# EAGLE schematic GPSSDver2 (EAGLE 9.6.2)
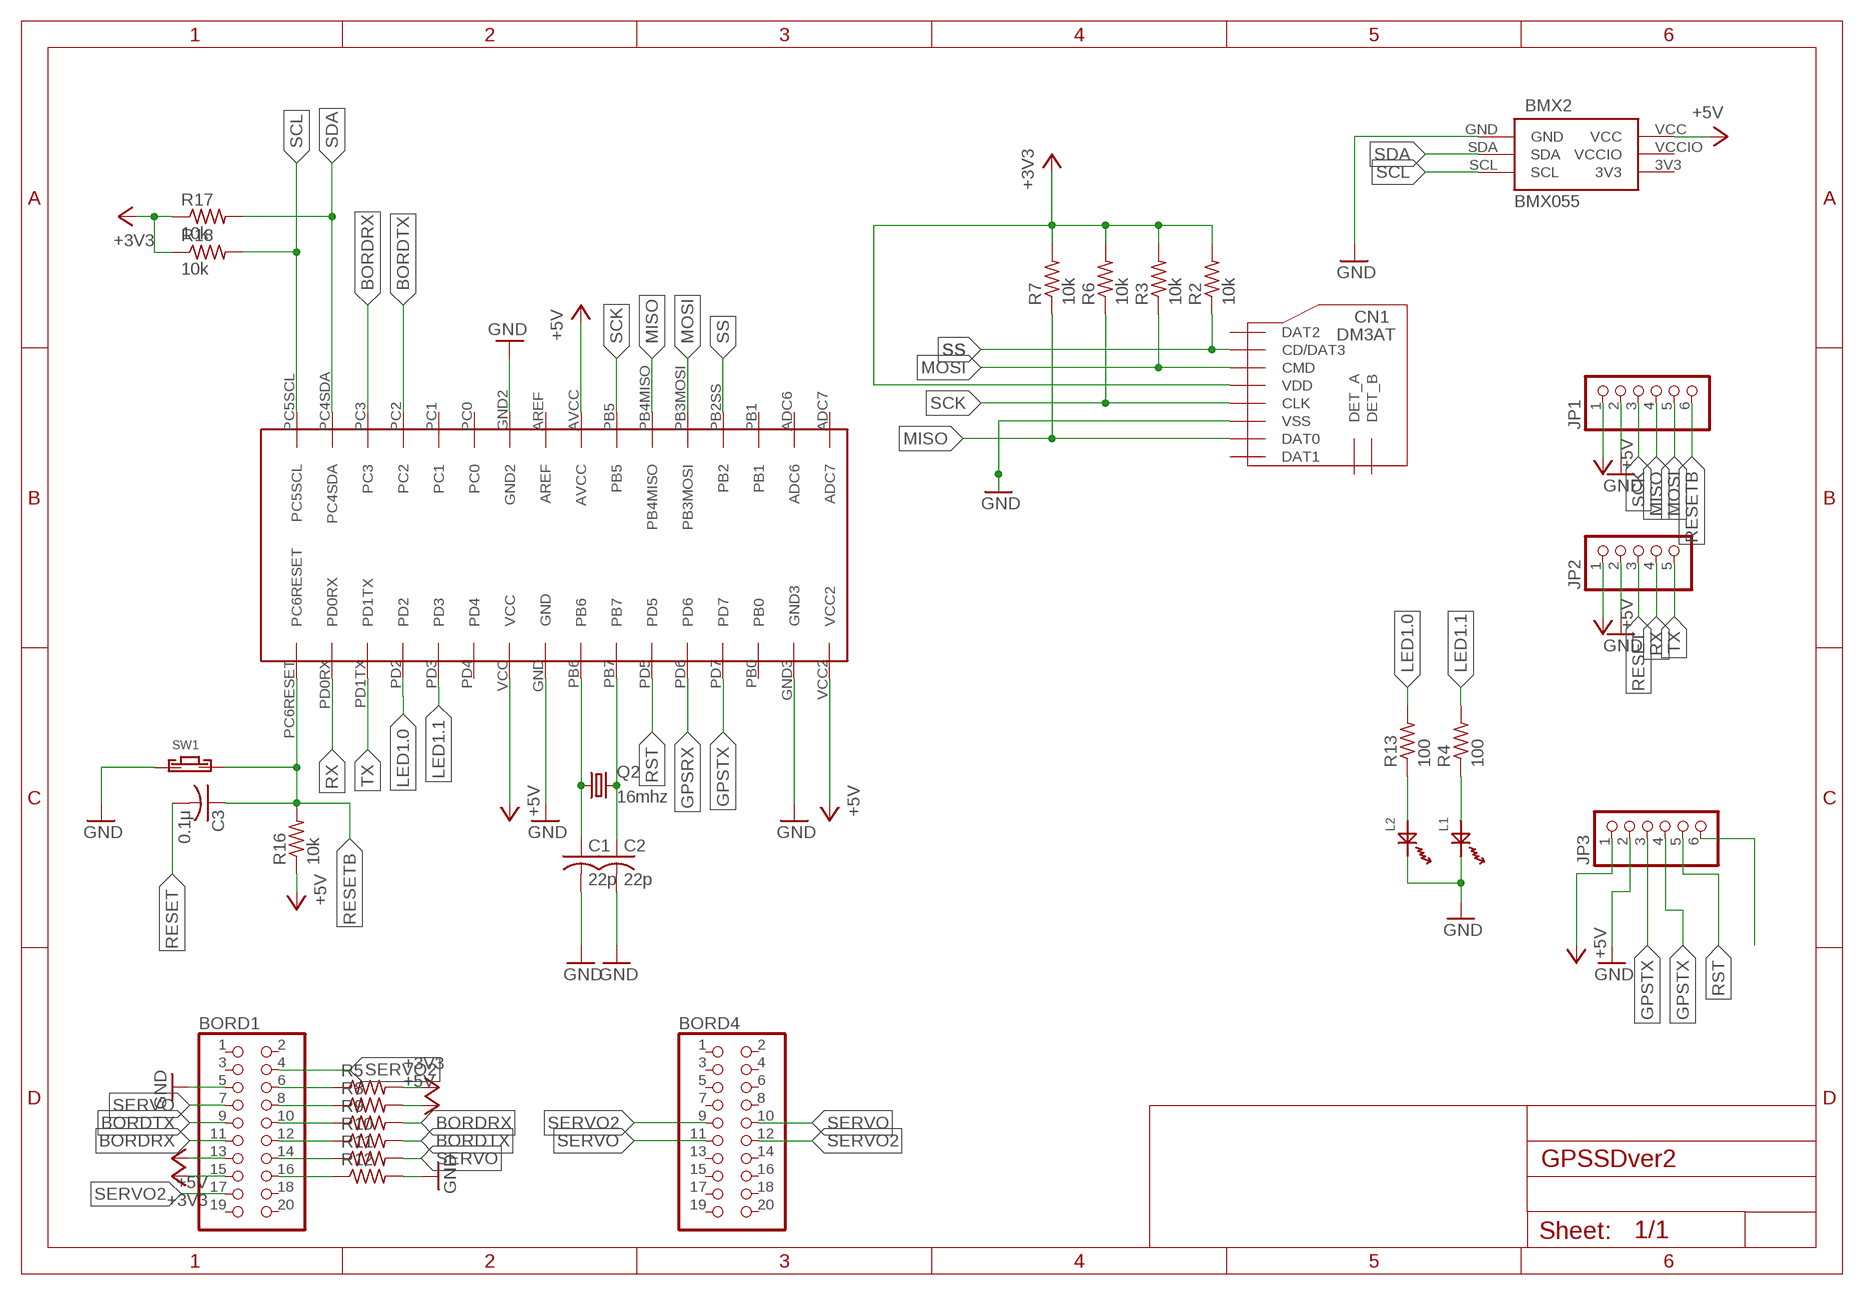
[diagram p0: schematic, sheet 1]

## Parts
BMX2  BMX055  [BMX055]
BORD1  PINHD-2X10/90  [2X10/90]
BORD4  PINHD-2X10/90  [2X10/90]
C1  22p  C-USC1608  [C1608]
C2  22p  C-USC1608  [C1608]
C3  0.1μ  C-USC1608  [C1608]
CN1  DM3AT  [DM3AT]
JP1  PINHD-1X6  [1X06]
JP2  PINHD-1X5  [1X05]
JP3  PINHD-1X6  [1X06]
L1  OSXX1608C1A  [OSXX1608C1A]
L2  OSXX1608C1A  [OSXX1608C1A]
Q2  16mhz  CRYSTALHC49UP  [HC49UP]
R2  10k  R-US_R0603  [R0603]
R3  10k  R-US_R0603  [R0603]
R4  100  R-US_R0603  [R0603]
R5  R-US_R0603  [R0603]
R6  10k  R-US_R0603  [R0603]
R7  10k  R-US_R0603  [R0603]
R8  R-US_R0603  [R0603]
R9  R-US_R0603  [R0603]
R10  R-US_R0603  [R0603]
R11  R-US_R0603  [R0603]
R12  R-US_R0603  [R0603]
R13  100  R-US_R0603  [R0603]
R16  10k  R-US_R0603  [R0603]
R17  10k  R-US_R0603  [R0603]
R18  10k  R-US_R0603  [R0603]
SW1  TVAF06-A020B-R  [TVAF06-A020B-R]
U$3  ATMEGA328P-AU  [QFP80P900X900X120-32N]

## Nets
+3V3: BORD1.15 CN1.VDD R2.2 R3.2 R5.2 R6.2 R7.2 R17.1 R18.1
+5V: BMX2.VCC BORD1.13 JP1.1 JP2.1 JP3.1 R8.2 R16.1 U$3.AVCC U$3.VCC U$3.VCC2
BORDRX: BORD1.11 R9.2 U$3.PC3
BORDTX: BORD1.9 R10.2 U$3.PC2
GND: BMX2.GND BORD1.5 C1.2 C2.2 CN1.VSS JP1.2 JP2.2 JP3.2 L1.CT L2.CT R12.2 SW1.P$1 U$3.GND U$3.GND2 U$3.GND3
GPSRX: U$3.PD6
GPSTX: JP3.3 JP3.4 U$3.PD7
LED1.0: R13.2 U$3.PD2
LED1.1: R4.2 U$3.PD3
MISO: CN1.DAT0 JP1.4 R7.1 U$3.PB4MISO
MOSI: CN1.CMD JP1.5 R3.1 U$3.PB3MOSI
N$1: L2.AN R13.1
N$2: BORD1.6 R5.1
N$3: BORD1.8 R8.1
N$4: BORD1.10 R9.1
N$5: JP3.6
N$8: BORD1.12 R10.1
N$9: BORD1.14 R11.1
N$10: BORD1.16 R12.1
N$11: L1.AN R4.1
N$13: C1.1 Q2.1 U$3.PB6
N$14: C2.1 Q2.2 U$3.PB7
RESET: C3.2 JP2.3
RESETB: C3.1 JP1.6 R16.2 SW1.P$2 U$3.PC6RESET
RST: JP3.5 U$3.PD5
RX: JP2.4 U$3.PD0RX
SCK: CN1.CLK JP1.3 R6.1 U$3.PB5
SCL: BMX2.SCL R18.2 U$3.PC5SCL
SDA: BMX2.SDA R17.2 U$3.PC4SDA
SERVO: BORD1.7 BORD4.10 BORD4.11 R11.2
SERVO2: BORD1.4 BORD1.17 BORD4.9 BORD4.12
SS: CN1.CD/DAT3 R2.1 U$3.PB2SS(PB2)
TX: JP2.5 U$3.PD1TX
Unconnected: BORD1.1 BORD1.2 BORD1.3 BORD1.18 BORD1.19 BORD1.20 BORD4.1 BORD4.2 BORD4.3 BORD4.4 BORD4.5 BORD4.6 BORD4.7 BORD4.8 BORD4.13 BORD4.14 BORD4.15 BORD4.16 BORD4.17 BORD4.18 BORD4.19 BORD4.20 CN1.DAT1 CN1.DAT2 CN1.DET_A CN1.DET_B U$3.ADC6 U$3.ADC7 U$3.AREF U$3.PB0 U$3.PB1 U$3.PC0 U$3.PC1 U$3.PD4

## Power pins joined to a net without a drawn wire
3V3: BMX2.3V3
VCCIO: BMX2.VCCIO

## Library data of the parts
BMX2 = BMX055:BMX055
BORD1 BORD4 = pinhead:PINHD-2X10: PIN HEADER
C1-C3 = rcl:C-US: CAPACITOR, American symbol; SPICEPREFIX: C
CN1 = microSD:DM3AT
JP1 JP3 = pinhead:PINHD-1X6: PIN HEADER
JP2 = pinhead:PINHD-1X5: PIN HEADER
L1 L2 = Chip LED:OSXX1608C1A
Q2 = crystal:CRYSTAL: CRYSTAL; OC_FARNELL: unknown; OC_NEWARK: unknown
R2-R13 R16-R18 = rcl:R-US_: RESISTOR, American symbol; SPICEPREFIX: R
SW1 = Tact switch:TVAF06-A020B-R
U$3 = ATMAGA328P-AU:ATMEGA328P-AU

## Net classes
0 default: width 0.406 mm